# EAGLE design Sudden_XCVF_Driver_Stage (EAGLE 9.2.2)
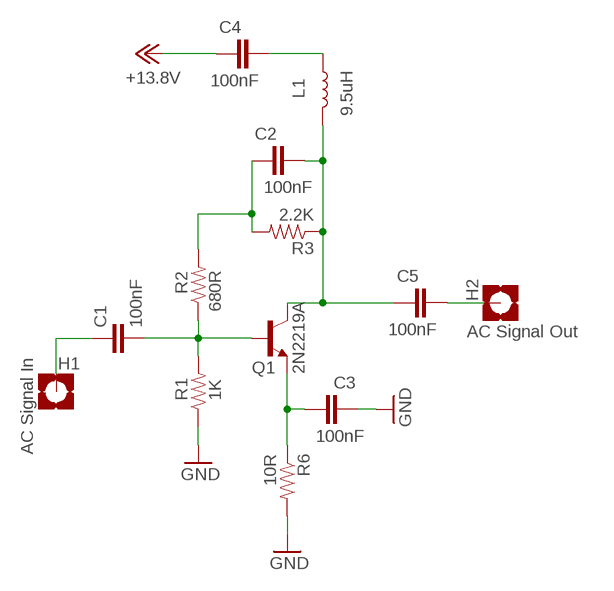
[diagram p0: schematic, sheet 1]

## Parts
C1  100nF  CAP-MEDIUM-MUPPET  [CAP-MEDIUM-MUPPET]
C2  100nF  CAP-MEDIUM-MUPPET  [CAP-MEDIUM-MUPPET]
C3  100nF  CAP-MEDIUM-MUPPET  [CAP-MEDIUM-MUPPET]
C4  100nF  CAP-MEDIUM-MUPPET  [CAP-MEDIUM-MUPPET]
C5  100nF  CAP-MEDIUM-MUPPET  [CAP-MEDIUM-MUPPET]
H1  AC Signal In  MOUNT-PAD-SQUARE4.5  [PAD-SQUARE]
H2  AC Signal Out  MOUNT-PAD-SQUARE4.5  [PAD-SQUARE]
L1  9.5uH  INDUCTOR-VLF4012AT-2.2UH  [INDUCTOR_2.2UH]
P+1  +13.8V  +12V  [POWER-IN-PAD]
Q1  2N2219A  2N2222  [2N2222-TO18]
R1  1K  RESISTOR-MUPPETMEDIUM-RESISTOR-PADS  [RESITOR-MUPPET]
R2  680R  RESISTOR-MUPPETMEDIUM-RESISTOR-PADS  [RESITOR-MUPPET]
R3  2.2K  RESISTOR-MUPPETMEDIUM-RESISTOR-PADS  [RESITOR-MUPPET]
R6  10R  RESISTOR-MUPPETMEDIUM-RESISTOR-PADS  [RESITOR-MUPPET]

## Nets
+12V: C4.1 P+1.VCC(+12V)
GND: C3.1 R1.P$1 R6.P$2
N$1: C1.2 Q1.2(B) R1.P$2 R2.P$1
N$2: C2.2 C5.1 L1.P$2 Q1.3(C) R3.P$1
N$3: C5.2 H2.PAD(MOUNT)
N$4: C2.1 R2.P$2 R3.P$2
N$5: C1.1 H1.PAD(MOUNT)
N$6: C4.2 L1.P$1
N$7: C3.2 Q1.1(E) R6.P$1

## Library data of the parts
C1-C5 = jim_muppet_parts:CAP-MEDIUM-MUPPET: Capacitor - Muppet style - Medium size SMT Pads 120 square SMT pads; PROD_ID: JIM-CAP Large SMT; VALUE: Set 0.0uF
H1 H2 = jim_muppet_parts:MOUNT-PAD-SQUARE: MOUNTING PAD, square
L1 = jim_muppet_parts:INDUCTOR: Inductors Resist changes in electrical current. Basically a coil of wire. SparkFun Products: SparkFun Load Cell Amplifier - HX711 <https://www.sparkfun.com/products/13879> IOIO-OTG - V2.2 <https://www.sparkfun.com/products/13613>; PROD_ID: NDUC-09513; VALUE: 2.2µH/±20%/1.5A
P+1 = jim_muppet_parts:+12V: SUPPLY SYMBOL
Q1 = jim_muppet_parts:2N2222: NPN TRANSISTOR
R1-R3 R6 = jim_muppet_parts:RESISTOR-MUPPET: Muppet stype resitor 120 square pad; PROD_ID: MUP-RES; VALUE: ohm

## Net classes
0 default: width 0.889 mm, clearance 0.94 mm

## Board
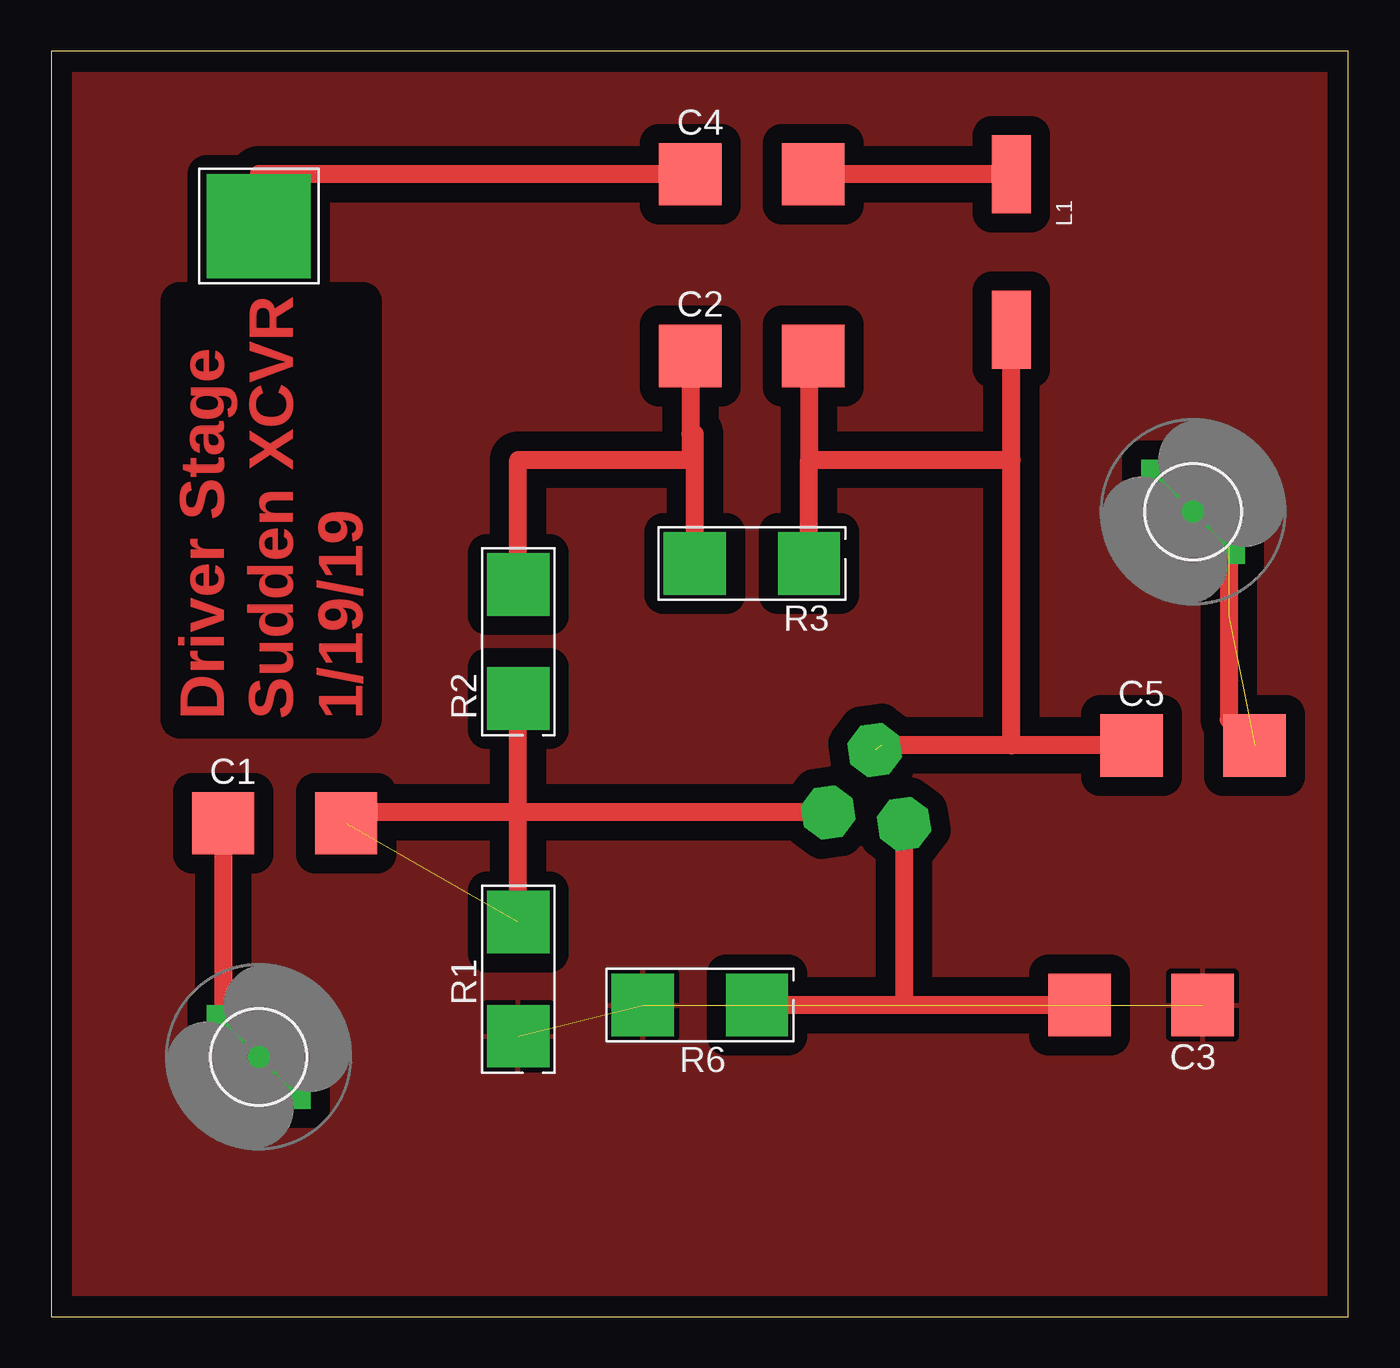
[diagram p1: board, top side]
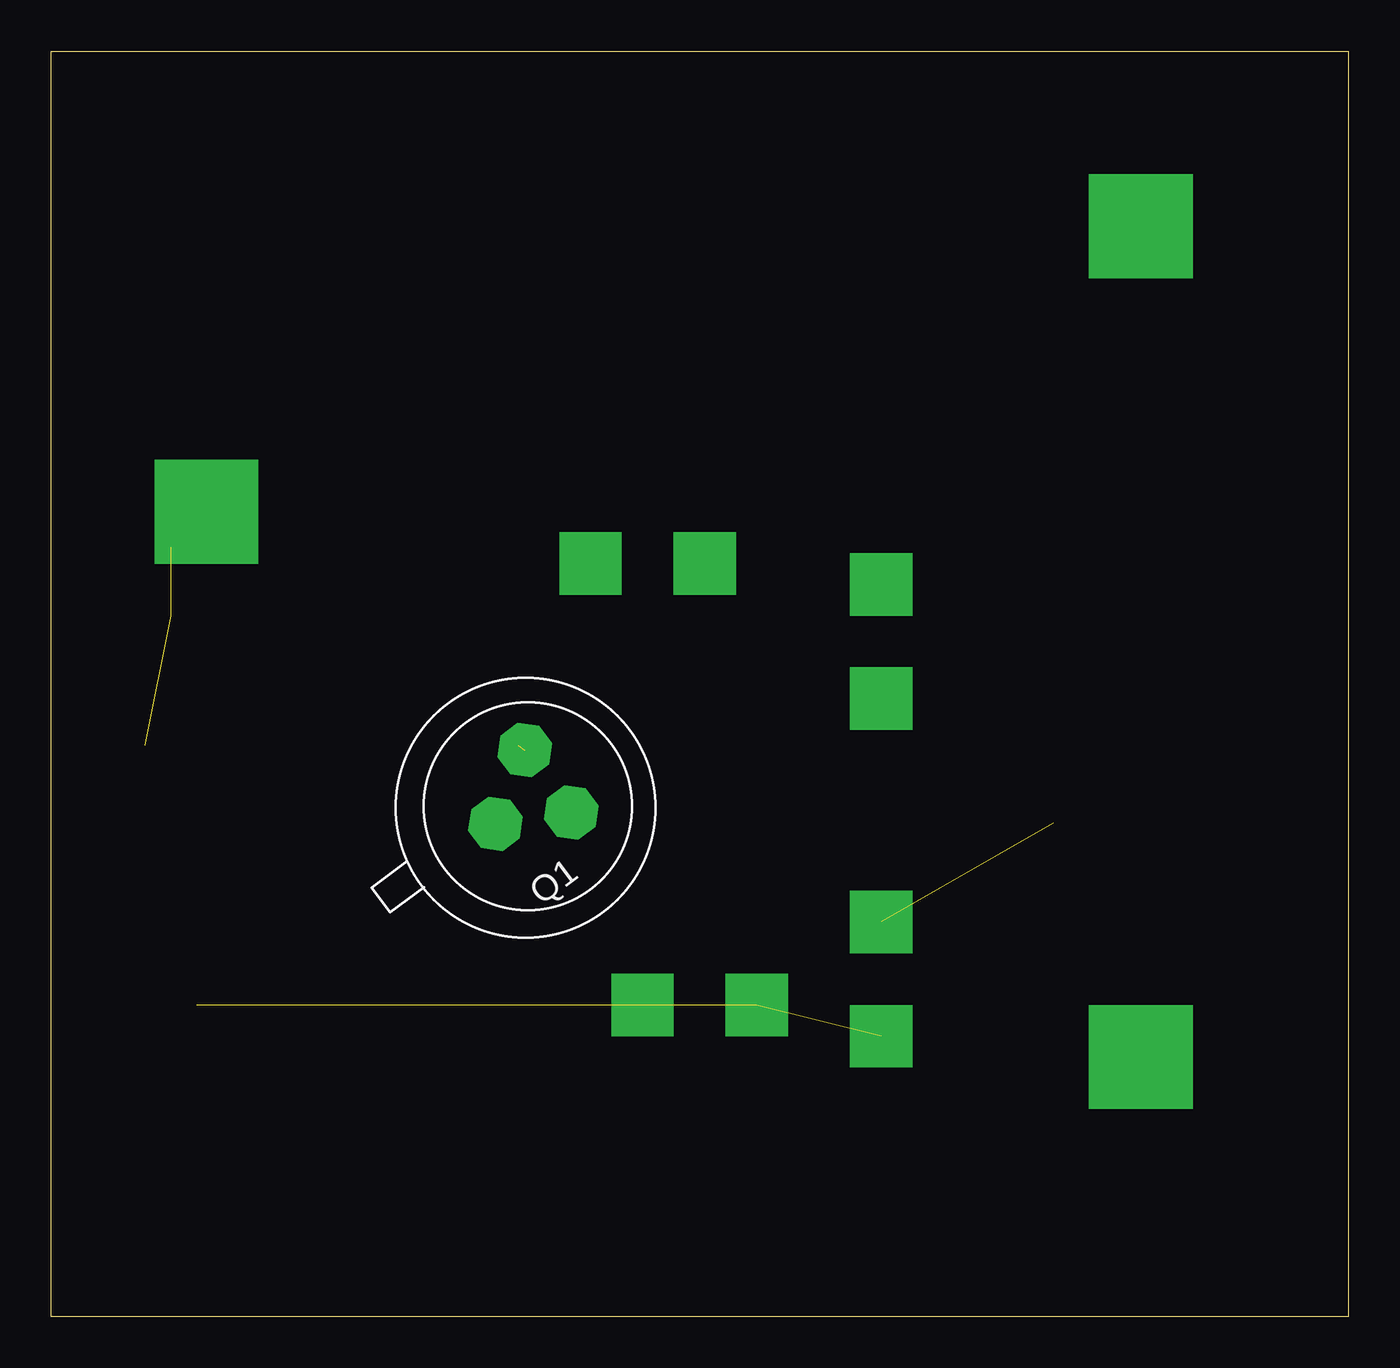
[diagram p2: board, bottom side, seen from below]

Size 63.48 x 61.9 mm. Coordinates in mm from the lower left corner, seen from the top.
Outline: 0,0 63.48,0 63.48,61.9 0,61.9 0,0
Copper layers (1*16): Top 0.035mm / dielectric 1.5mm / Bottom 0.035mm
Design rules "default": minimum track width 6mil, minimum drill 0.35mm, track to track 6mil, track to pad 6mil, pad to pad 6mil, via to via 6mil, smd to smd 6mil, copper to edge 40mil, drill to drill 6mil, minimum pad ring 10mil, minimum via ring 8mil, stop-mask expansion 4mil, vias tented up to drill 0mil, thermal gap 10mil

### Footprints (pad centres in the part's own frame; a part is rotated, then mirrored left to right if it is on the bottom)
CAP-MEDIUM-MUPPET = smd 3.048 x 3.048: 1 -3.009,0; 2 3.009,0
PAD-SQUARE = drill 0 pad 5.08 square: PAD 0,0
INDUCTOR_2.2UH = smd 3.81 x 1.905: P$1 -3.805,0; P$2 3.805,0
POWER-IN-PAD = drill 0 pad 5.08 square: VCC 0,0
2N2222-TO18 = drill 0 pad 2.54 octagon: 1 0.127,-0.127; 2 3.429,-1.905; 3 3.429,1.905
RESITOR-MUPPET = drill 0 pad 3.048 square: P$1 -2.794,0; P$2 2.794,0

### Placement (x,y rotation side)
C1  11.43,24.13 0 top
C2  34.29,46.99 0 top
C3  53.34,15.24 180 top
C4  34.29,55.88 0 top
C5  55.88,27.94 0 top
H1  10.16,12.7 0 top
H2  55.88,39.37 0 top
L1  46.99,52.07 270 top
P+1  10.16,53.34 0 top
Q1  41.91,24.13 36.8 bottom
R1  22.86,16.51 90 top
R2  22.86,33.02 90 top
R3  34.29,36.83 180 top
R6  31.75,15.24 180 top

### Tracks (layer width: path | path; a pad name or v marks a point on that pad's centre or on a via)
+12V
  Top 0.889: C4.1 10.16,55.88 P+1.VCC
GND  (2 unrouted)
  pour Top: 0,0 0,66.04 63.5,66.04 63.5,0
N$1  (1 unrouted)
  Top 0.889: Q1.2 14.44,24.66 C1.2 | R1.P$2 R2.P$1
N$2  (1 unrouted)
  Top 0.889: C5.1 46.99,27.94 | 46.99,27.94 40.64,27.94 | R3.P$1 37.08,41.91 | C2.2 37.08,46.77 37.08,41.91 | 37.08,41.91 46.99,41.91 | 46.99,41.91 L1.P$2 | 46.99,27.94 46.99,41.91
N$3  (2 unrouted)
  Top 0.889: C5.2 57.62,29.21 57.62,37.63 H2.PAD
N$4
  Top 0.889: R3.P$2 31.5,43.18 31.28,43.18 | R2.P$2 22.86,41.91 31.28,41.91 31.28,43.18 | C2.1 31.28,43.18
N$5
  Top 0.889: C1.1 8.42,12.7 H1.PAD
N$6
  Top 0.152: C4.2
  Top 0.889: L1.P$1 C4.2
N$7
  Top 0.889: C3.2 41.73,15.24 | 41.73,15.24 R6.P$1 | Q1.1 41.73,15.24

### Text on the board
Top: Driver Stage / Sudden XCVR / 1/19/19